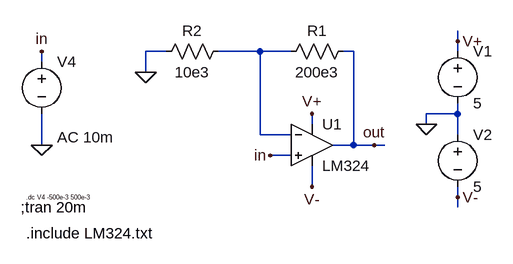
[diagram p0: schematic Aufgabe_1.2_NichtInvertierenderVerstaerker_DCSweep.asc]
Aufgabe_1.2_NichtInvertierenderVerstaerker_DCSweep.asc, the LTspice schematic file:
Version 4
SHEET 1 880 680
WIRE 416 -16 416 -32
WIRE -32 0 -64 0
WIRE 112 0 48 0
WIRE 160 0 112 0
WIRE 256 0 240 0
WIRE 416 0 416 -16
WIRE -224 16 -224 0
WIRE -64 32 -64 0
WIRE 416 96 416 80
WIRE 416 96 368 96
WIRE 192 112 192 96
WIRE 368 112 368 96
WIRE 112 128 112 0
WIRE 160 128 112 128
WIRE 416 128 416 96
WIRE -224 144 -224 96
WIRE 256 144 256 0
WIRE 256 144 224 144
WIRE 288 144 256 144
WIRE 304 144 288 144
WIRE 160 160 128 160
WIRE 192 208 192 176
WIRE 416 224 416 208
WIRE 416 240 416 224
FLAG 368 112 0
FLAG 416 -16 V+
FLAG 416 224 V-
FLAG 192 96 V+
FLAG 192 208 V-
FLAG 288 144 out
FLAG -224 144 0
FLAG -64 32 0
FLAG -224 0 in
FLAG 128 160 in
SYMBOL Opamps\\opamp2 192 80 R0
SYMATTR InstName U1
SYMATTR Value LM324
SYMBOL voltage 416 -16 R0
WINDOW 123 0 0 Left 2
WINDOW 39 0 0 Left 2
SYMATTR InstName V1
SYMATTR Value 5
SYMBOL voltage 416 112 R0
WINDOW 123 0 0 Left 2
WINDOW 39 0 0 Left 2
SYMATTR InstName V2
SYMATTR Value 5
SYMBOL res 256 -16 R90
WINDOW 0 0 56 VBottom 2
WINDOW 3 32 56 VTop 2
SYMATTR InstName R1
SYMATTR Value 200e3
SYMBOL res 64 -16 R90
WINDOW 0 0 56 VBottom 2
WINDOW 3 32 56 VTop 2
SYMATTR InstName R2
SYMATTR Value 10e3
SYMBOL voltage -224 0 R0
WINDOW 123 24 132 Left 2
WINDOW 39 0 0 Left 2
WINDOW 3 24 160 Left 2
SYMATTR Value2 AC 10m
SYMATTR Value ""
SYMATTR InstName V4
TEXT -248 280 Left 2 !.include LM324.txt
TEXT -256 240 Left 2 !;tran 20m
TEXT -248 224 Left 0 !.dc V4 -500e-3 500e-3

The netlist it stands for:
* Aufgabe_1.2_NichtInvertierenderVerstaerker_DCSweep.asc
XU1 in N001 V+ V- out LM324  ; pins In+ In- V+ V- OUT
V1 V+ 0 5
V2 0 V- 5
R1 out N001 200e3
R2 N001 0 10e3
V4 in 0 AC 10m
.include LM324.txt
;tran 20m
.dc V4 -500e-3 500e-3
.backanno
.end